# Altium schematic sheet Encoders.SchDoc
size A
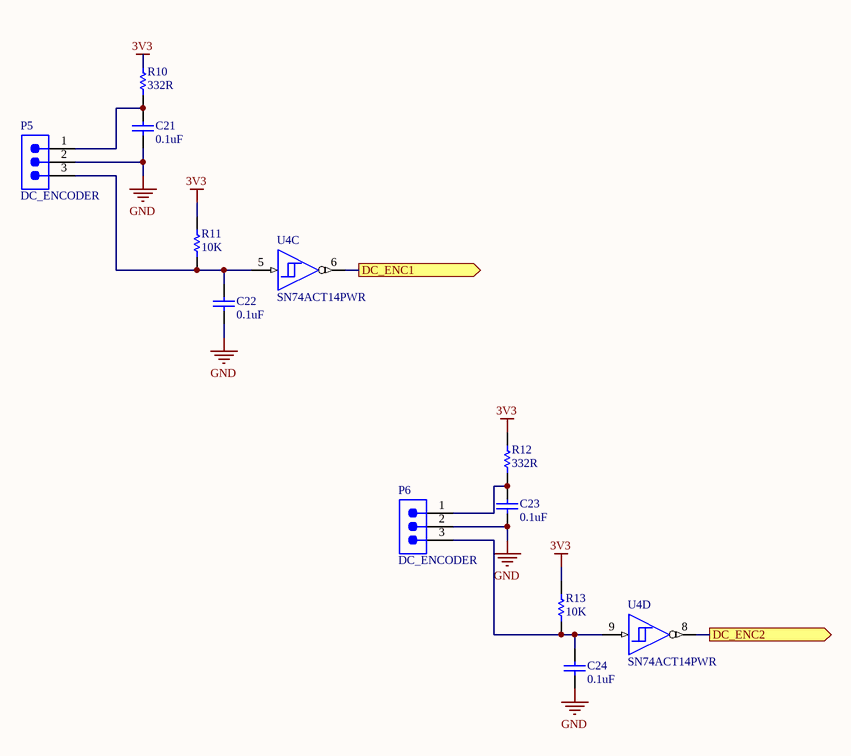
[diagram p0: Encoders.SchDoc]

## Parts
C21  0.1uF  [CAPC1608X90X35LL15T15]
C22  0.1uF  [CAPC1608X90X35LL15T15]
C23  0.1uF  [CAPC1608X90X35LL15T15]
C24  0.1uF  [CAPC1608X90X35LL15T15]
P5  DC_ENCODER  [SMTC-TSW-103-07-X-S]
P6  DC_ENCODER  [SMTC-TSW-103-07-X-S]
R10  332R  [RESC1608X55X30ML15T15]
R11  10K  [RESC1609X50X30ML10T20]
R12  332R  [RESC1608X55X30ML15T15]
R13  10K  [RESC1609X50X30ML10T20]
U4  SN74ACT14PWR  [PW0014A_N]  (parts C,D of 7)

## Ports
DC_ENC1 (out), DC_ENC2 (out)

## Nets
3V3: R10.2 R11.1 R12.2 R13.1
GND: C21.1 C22.1 C23.1 C24.1 P5.2(Ground) P6.2(Ground)
DC_ENC1: U4.6(~{3Y}) ; port DC_ENC1
DC_ENC2: U4.8(~{4Y}) ; port DC_ENC2
NetC21_2: C21.2 P5.1(5V) R10.1
NetC22_2: C22.2 P5.3(Signal) R11.2 U4.5(3A)
NetC23_2: C23.2 P6.1(5V) R12.1
NetC24_2: C24.2 P6.3(Signal) R13.2 U4.9(4A)

## Library data of the parts
C21-C24 = CMP-2006-04389-2: Chip Capacitor, 100 nF, +/- 10%, 50 V, -55 to 125 degC, 0603 (1608 Metric), RoHS, Tape and Reel; Case\Package: 0603; Type (Capacitors): X7R; Capacitance: 100 nF; Voltage Rating: 50 V; Pins: 2; Max Operating Temperature: 125 degC; Min Operating Temperature: -55 degC; Case Code (Imperial): 0603; DatasheetVersion: 07/2016; Package Quantity: 4000; Length: 1.6 mm; REACH SVHC: No SVHC; Packaging: Tape and Reel; Case Code (Metric): 1608; Mounting Technology: Surface Mount; RoHSCompliant: true; Height: 0.9 mm; ComponentLink1URL: http://www.avx.com/; ComponentLink2URL: http://datasheets.avx.com/X7RDielectric.pdf; Mount: Surface Mount; ComponentLink2Description: Datasheet; Width: 0.81 mm; PackageReference: 0603; PackageDescription: 2-Pin Surface Mount Device, Body 1.6 x 0.81 mm; Radiation Hardening: No; ComponentLink1Description: Manufacturer URL; Voltage Rating (DC): 50 V; Tolerance: 10%
P5 P6 = CMP-1024-00334-1: 0.025" SQ Post Header, Through-hole, Vertical, -55 to 125 degC, 2.54 mm Pitch, 3-Pin, Male, RoHS; Manufacturer: Samtec; PartNumber: TSW-103-07-L-S; Pitch: 2.54 mm; Mounting Technology: Through-hole; ComponentLink2URL: http://www.samtec.com/documents/webfiles/pdf/TSW_TH.PDF; ComponentLink3Description: Package Specification; PackageVersion: DM, 8/1988; PackageReference: TSW-103-07-X-S; Orientation: Vertical; ComponentLink1URL: http://www.samtec.com; PackageDescription: .025[0.64] SQ. Post Terminal Strip Assembly; ComponentLink1Description: Manufacturer URL; ComponentLink2Description: Datasheet; ComponentLink3URL: http://www.samtec.com/documents/webfiles/cpdf/TSW-XXX-XX-XXX-X-XX-XXX-MKT.pdf; RoHS: True; DatasheetVersion: F-214; Temperature Range: -55 to 125 degC
R10 R12 = CMP-2000-00439-1: Part Number: ERJ-3EKF3320V; Manufacturer: Panasonic
R11 R13 = CMP-2000-03838-1: Manufacturer: Vishay Dale; Part Number: CRCW060310K0JNEA
U4 = CMP-0268-00001-5: Hex Schmitt-Trigger Inverters, PW0014A, LARGE T&R; Manufacturer: Texas Instruments; Voltage(Nom)(V): 5; F @ Nom Voltage(Max)(Mhz): 90; Input Type: TTL; tpd @ Nom Voltage(Max)(ns): 12.5; Output Type: CMOS; Bits(#): 6; VCC(Max)(V): 5.5; Technology Family: ACT; Output Drive (IOL/IOH)(Max)(mA): -24/24; ICC @ Nom Voltage(Max)(mA): 0.02; Schmitt Trigger: Yes; VCC(Min)(V): 4.5; Rating: Catalog; Code_JEDEC: MO-153; PackageReference: PW0014A; Operating Temperature Range(C): -40 to 85; Generic Part Number: SN74ACT14; DatasheetVersion: SCAS557H